# Altium schematic sheet Power Supply_2.SchDoc
size A3; PageSetup: Record=PageOptions|CenterHorizontal=True|CenterVertical=True|PrintScale=0.71|XCorrection=1.00|YCorrection=1.00|PrintKind=1|BorderSize=5000000|LeftOffset=0|BottomOffset=0|Orientation=2|PaperLength=1000|PaperWidth=1000|Scale=100|PaperSource=15|PrintQuality=4000|MediaType=1|DitherType=10|PrintScaleMode=1|PaperKind=A4|PaperIndex=9
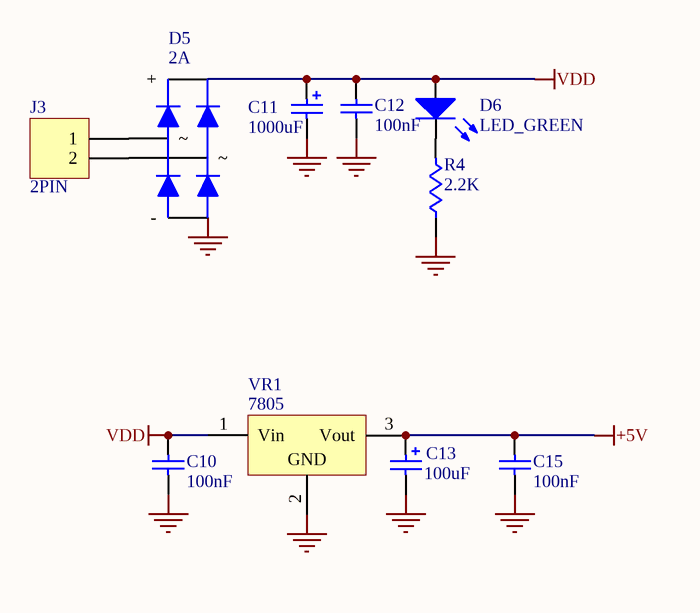
[diagram p0: Power Supply_2.SchDoc]

## Parts
C10  100nF  [CAPNTO2.54-3.05x1.78A]
C11  1000uF  [CAPPR5-10x12.5]
C12  100nF  [CAPNTO2.54-3.05x1.78A]
C13  100uF  [CAPPR2.5-6.3x5]
C15  100nF  [CAPNTO2.54-3.05x1.78A]
D5  2A  [BRIDGE-1]
D6  LED_GREEN  [LED-5mm_Red]
J3  2PIN  [Fonics_2PIN_1]
R4  2.2K  [AXIAL-0.4]
VR1  7805  [TO220V]

## Nets
+5V: C13.1 C15.2 VR1.3(Vout)
GND: C10.1 C11.2 C12.1 C13.2 C15.1 D5.1(-) R4.1 VR1.2(GND)
VDD: C10.2 C11.1 C12.2 D5.3(+) D6.1(A) VR1.1(Vin)
NetD5_2: D5.2 J3.2
NetD5_4: D5.4 J3.1
NetD6_2: D6.2(K) R4.2

## Library data of the parts
C10 C12 C15 = Cap: Capacitor; Manufacturer: Generic Components; Class I: Passive; Published: 8-Jun-2000; Revision: July-2002: Re-released for DXP Platform.; Publisher: Altium Limited; Class II: Capacitor
C11 C13 = Cap Pol1: Polarized Capacitor (Radial); Manufacturer: Generic Components; Class I: Passive; Published: 8-Jun-2000; Revision: July-2002: Re-released for DXP Platform.; Publisher: Altium Limited; Class II: Capacitor
D5 = Bridge_1: Full Wave Diode Bridge; Manufacturer: Generic Components; Class I: Discrete; Class II: Rectifier - Bridge; Published: 8-Jun-2000; Revision: July-2002: Re-released for DXP Platform.; Publisher: Altium Limited
D6 = LED: Typical INFRARED GaAs LED; Manufacturer: Generic Components; Class I: Optoelectronic; Published: 8-Jun-2000; Revision: July-2002: Re-released for DXP Platform.; Publisher: Altium Limited; Class II: LED
J3 = Header 2: Header, 2-Pin; LatestRevisionDate: 17-Jul-2002; LatestRevisionNote: Re-released for DXP Platform.; Publisher: Altium Limited
R4 = Res1: Resistor; Manufacturer: Generic Components; Class I: Passive; Published: 8-Jun-2000; Revision: July-2002: Re-released for DXP Platform.; Publisher: Altium Limited; Class II: Resistor
VR1 = Volt Reg: Voltage Regulator; Manufacturer: Generic Components; Class I: Power Management; Published: 24-Mar-1999; Revision: July-2002: Re-released for DXP Platform.; Publisher: Altium Limited; Class II: Voltage Regulator